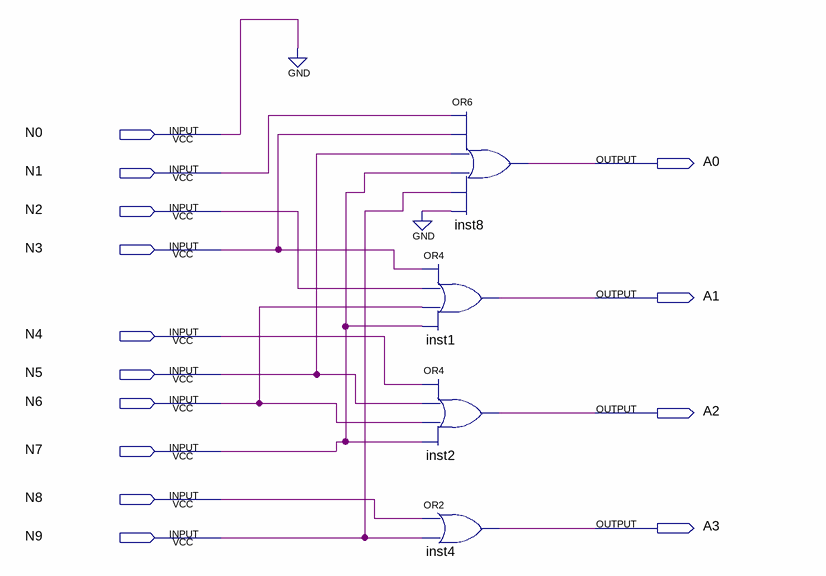
[diagram p0: schematic sheet]
// Quartus schematic Cod9a4.bdf as structural Verilog: 4 symbols, 14 pins
module Cod9a4 (
  input  N0,
  input  N1,
  input  N2,
  input  N3,
  input  N4,
  input  N5,
  input  N6,
  input  N7,
  input  N8,
  input  N9,
  output A0,
  output A1,
  output A2,
  output A3
);

  or inst8 (A0, N1, N3, N5, N7, N9, 1'b0);
  or inst1 (A1, N3, N2, N6, N7);
  or inst2 (A2, N4, N5, N6, N7);
  or inst4 (A3, N8, N9);
  // also tied to GND on the sheet: N0
endmodule
